# Altium project termometr.PrjPCB
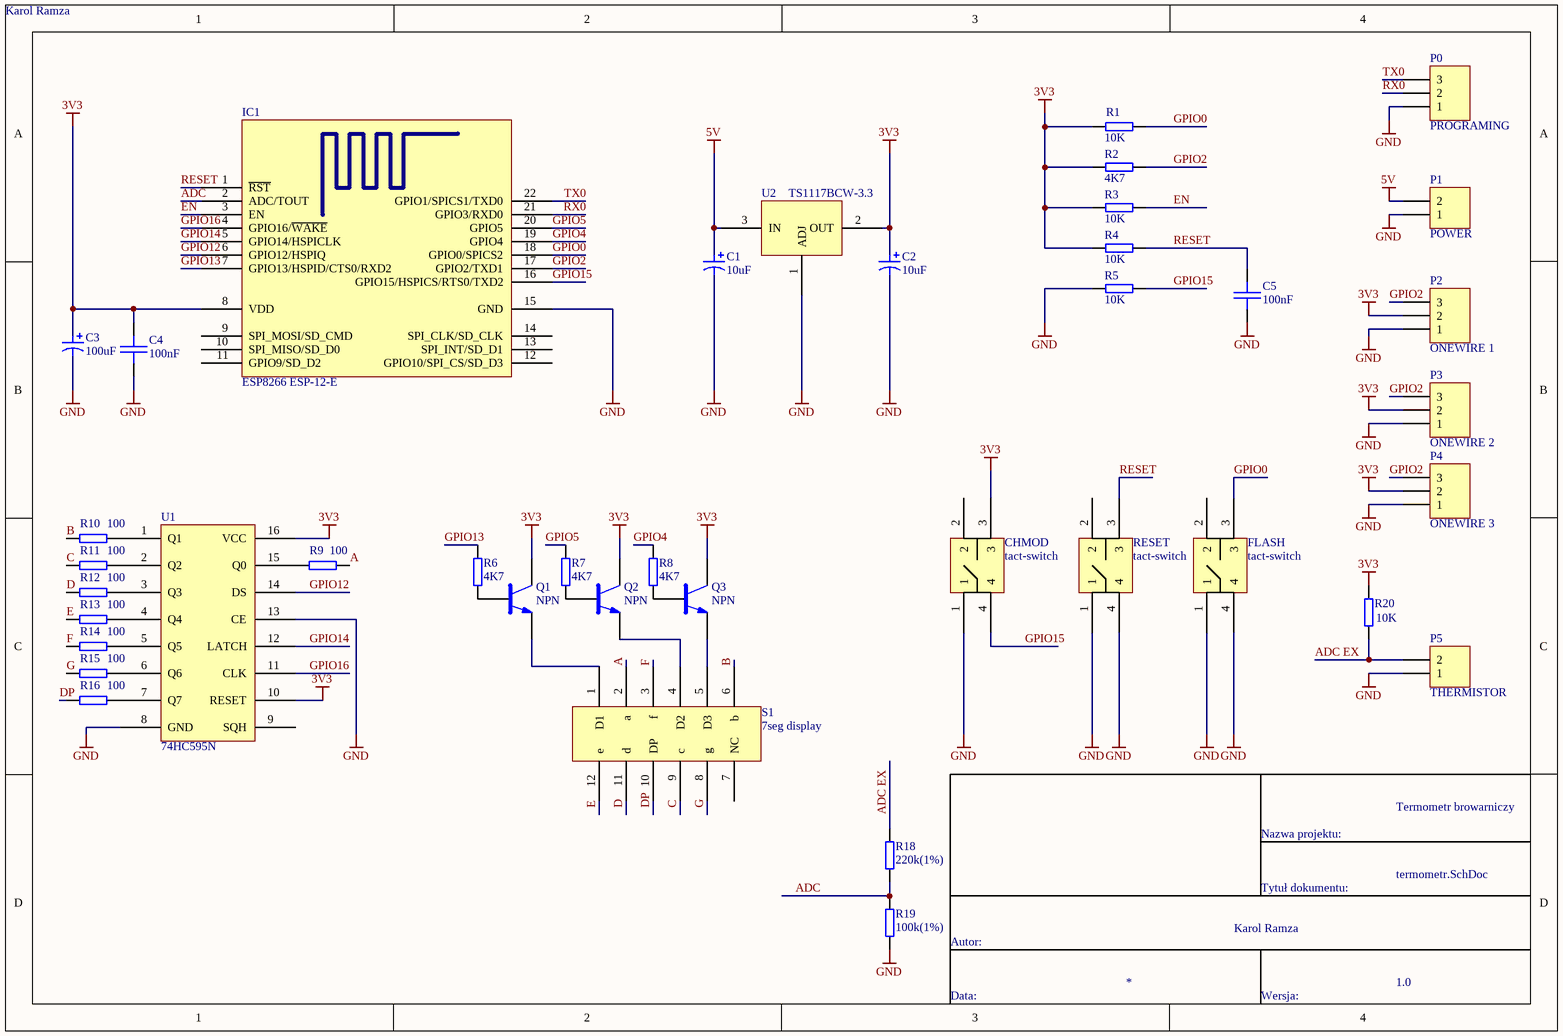
[diagram p0: termometr.SchDoc]
Wersja: 1.0; Title: Termometr browarniczy; Autor: Karol Ramza
1 sheet, 40 parts. Net scope: global (net labels, ports and power ports of the same name join across sheets).
Board file: termometr.PcbDoc

## Sheet termometr.SchDoc: Termometr browarniczy
size A4; Author: Karol Ramza; Wersja: 1.0

### Parts
C1  10uF  [THT CAPACITOR_ELECTROLITIC]
C2  10uF  [THT CAPACITOR_ELECTROLITIC]
C3  100uF  [THT CAPACITOR_ELECTROLITIC]
C4  100nF  [THT CAP CERAMIC]
C5  100nF  [THT CAP CERAMIC]
CHMOD  tact-switch  [tact-switch]
FLASH  tact-switch  [tact-switch]
IC1  ESP8266 ESP-12-E  [ESP8266 ESP-12-E]
P0  PROGRAMING  [3pin 2.54]
P1  POWER  [DC_BARREL]
P2  ONEWIRE 1  [Molex KK 254 socket 3pin]
P3  ONEWIRE 2  [Molex KK 254 socket 3pin]
P4  ONEWIRE 3  [Molex KK 254 socket 3pin]
P5  THERMISTOR  [Molex KK 254 socket 2pin]
Q1  NPN  [SOT-23]
Q2  NPN  [SOT-23]
Q3  NPN  [SOT-23]
R1  10K  [THT resistor]
R2  4K7  [THT resistor]
R3  10K  [THT resistor]
R4  10K  [THT resistor]
R5  10K  [THT resistor]
R6  4K7  [THT resistor]
R7  4K7  [THT resistor]
R8  4K7  [THT resistor]
R9  100  [THT resistor]
R10  100  [THT resistor]
R11  100  [THT resistor]
R12  100  [THT resistor]
R13  100  [THT resistor]
R14  100  [THT resistor]
R15  100  [THT resistor]
R16  100  [THT resistor]
R18  220k(1%)  [THT resistor]
R19  100k(1%)  [THT resistor]
R20  10K  [THT resistor]
RESET  tact-switch  [tact-switch]
S1  7seg display  [7seg display]
U1  74HC595N  [74HC595N]
U2  TS1117BCW-3.3  [SOT-223-2]

### Nets
3V3: C2.1 C3.1 C4.1 CHMOD.3 IC1.8(VDD) P2.2 P3.2 P4.2 Q1.3 Q2.3 Q3.3 R1.1 R2.1 R3.1 R4.1 R20.2 U1.10(RESET) U1.16(VCC) U2.2(OUT)
5V: C1.1 P1.2 U2.3(IN)
GND: C1.2 C2.2 C3.2 C4.2 C5.2 CHMOD.1 FLASH.1 FLASH.4 IC1.15(GND) P0.1 P1.1 P2.1 P3.1 P4.1 P5.1 R5.1 R19.1 RESET.1 RESET.4 U1.8(GND) U1.13(CE) U2.1(ADJ)
A: R9.2 S1.2(a)
ADC: IC1.2(ADC/TOUT) R18.1 R19.2
ADC EX: P5.2 R18.2 R20.1
B: R10.1 S1.6(b)
C: R11.1 S1.9(c)
D: R12.1 S1.11(d)
DP: R16.1 S1.10(DP)
E: R13.1 S1.12(e)
EN: IC1.3(EN) R3.2
F: R14.1 S1.3(f)
G: R15.1 S1.8(g)
GPIO0: FLASH.3 IC1.18(GPIO0/SPICS2) R1.2
GPIO2: IC1.17(GPIO2/TXD1) P2.3 P3.3 P4.3 R2.2
GPIO4: IC1.19(GPIO4) R8.2
GPIO5: IC1.20(GPIO5) R7.2
GPIO12: IC1.6(GPIO12/HSPIQ) U1.14(DS)
GPIO13: IC1.7(GPIO13/HSPID/CTS0/RXD2) R6.2
GPIO14: IC1.5(GPIO14/HSPICLK) U1.12(LATCH)
GPIO15: CHMOD.4 IC1.16(GPIO15/HSPICS/RTS0/TXD2) R5.2
GPIO16: IC1.4(GPIO16/~{WAKE}) U1.11(CLK)
RESET: C5.1 IC1.1(~{RST}) R4.2 RESET.3
RX0: IC1.21(GPIO3/RXD0) P0.2
TX0: IC1.22(GPIO1/SPICS1/TXD0) P0.3
NetQ1_1: Q1.1 R6.1
NetQ1_2: Q1.2 S1.1(D1)
NetQ2_1: Q2.1 R7.1
NetQ2_2: Q2.2 S1.4(D2)
NetQ3_1: Q3.1 R8.1
NetQ3_2: Q3.2 S1.5(D3)
NetR9_1: R9.1 U1.15(Q0)
NetR10_2: R10.2 U1.1(Q1)
NetR11_2: R11.2 U1.2(Q2)
NetR12_2: R12.2 U1.3(Q3)
NetR13_2: R13.2 U1.4(Q4)
NetR14_2: R14.2 U1.5(Q5)
NetR15_2: R15.2 U1.6(Q6)
NetR16_2: R16.2 U1.7(Q7)

Not connected (* = marked no-connect by the designer): CHMOD 2; FLASH 2; IC1 9(SPI_MOSI/SD_CMD) 10(SPI_MISO/SD_D0) 11(GPIO9/SD_D2) 12(GPIO10/SPI_CS/SD_D3) 13(SPI_INT/SD_D1) 14(SPI_CLK/SD_CLK); RESET 2; S1 7(NC); U1 9(SQH)

### Notes on the sheet
- Nazwa projektu:
- Tytuł dokumentu:
- Autor:
- Data:
- Wersja:

### Library data of the parts
C1 C2 = C Pol: Polarized Capacitor; Value: 100uF; Publisher: Kamil Pawliczak; HelpURL: c:\altium\biblioteki\elementy_bierne\doc\kondensator_pol.txt
C3 = C Pol: Polarized Capacitor; Publisher: Kamil Pawliczak; Value: 100uF; HelpURL: c:\altium\biblioteki\elementy_bierne\doc\kondensator_pol.txt
C4 C5 = CAP: capacitor
P0 P2-P4 = Header 3: Header, 3-Pin; LatestRevisionDate: 17-Jul-2002; LatestRevisionNote: Re-released for DXP Platform.; Publisher: Altium Limited
P1 P5 = Header 2: Header, 2-Pin; LatestRevisionDate: 17-Jul-2002; LatestRevisionNote: Re-released for DXP Platform.; Publisher: Altium Limited
R1-R16 R20 = RES: resistor
R18 R19 = SMT_R_0402: Surface mount resistor 0402
U2 = ldo sot-223